# EAGLE schematic board_V2 (EAGLE 9.3.1)
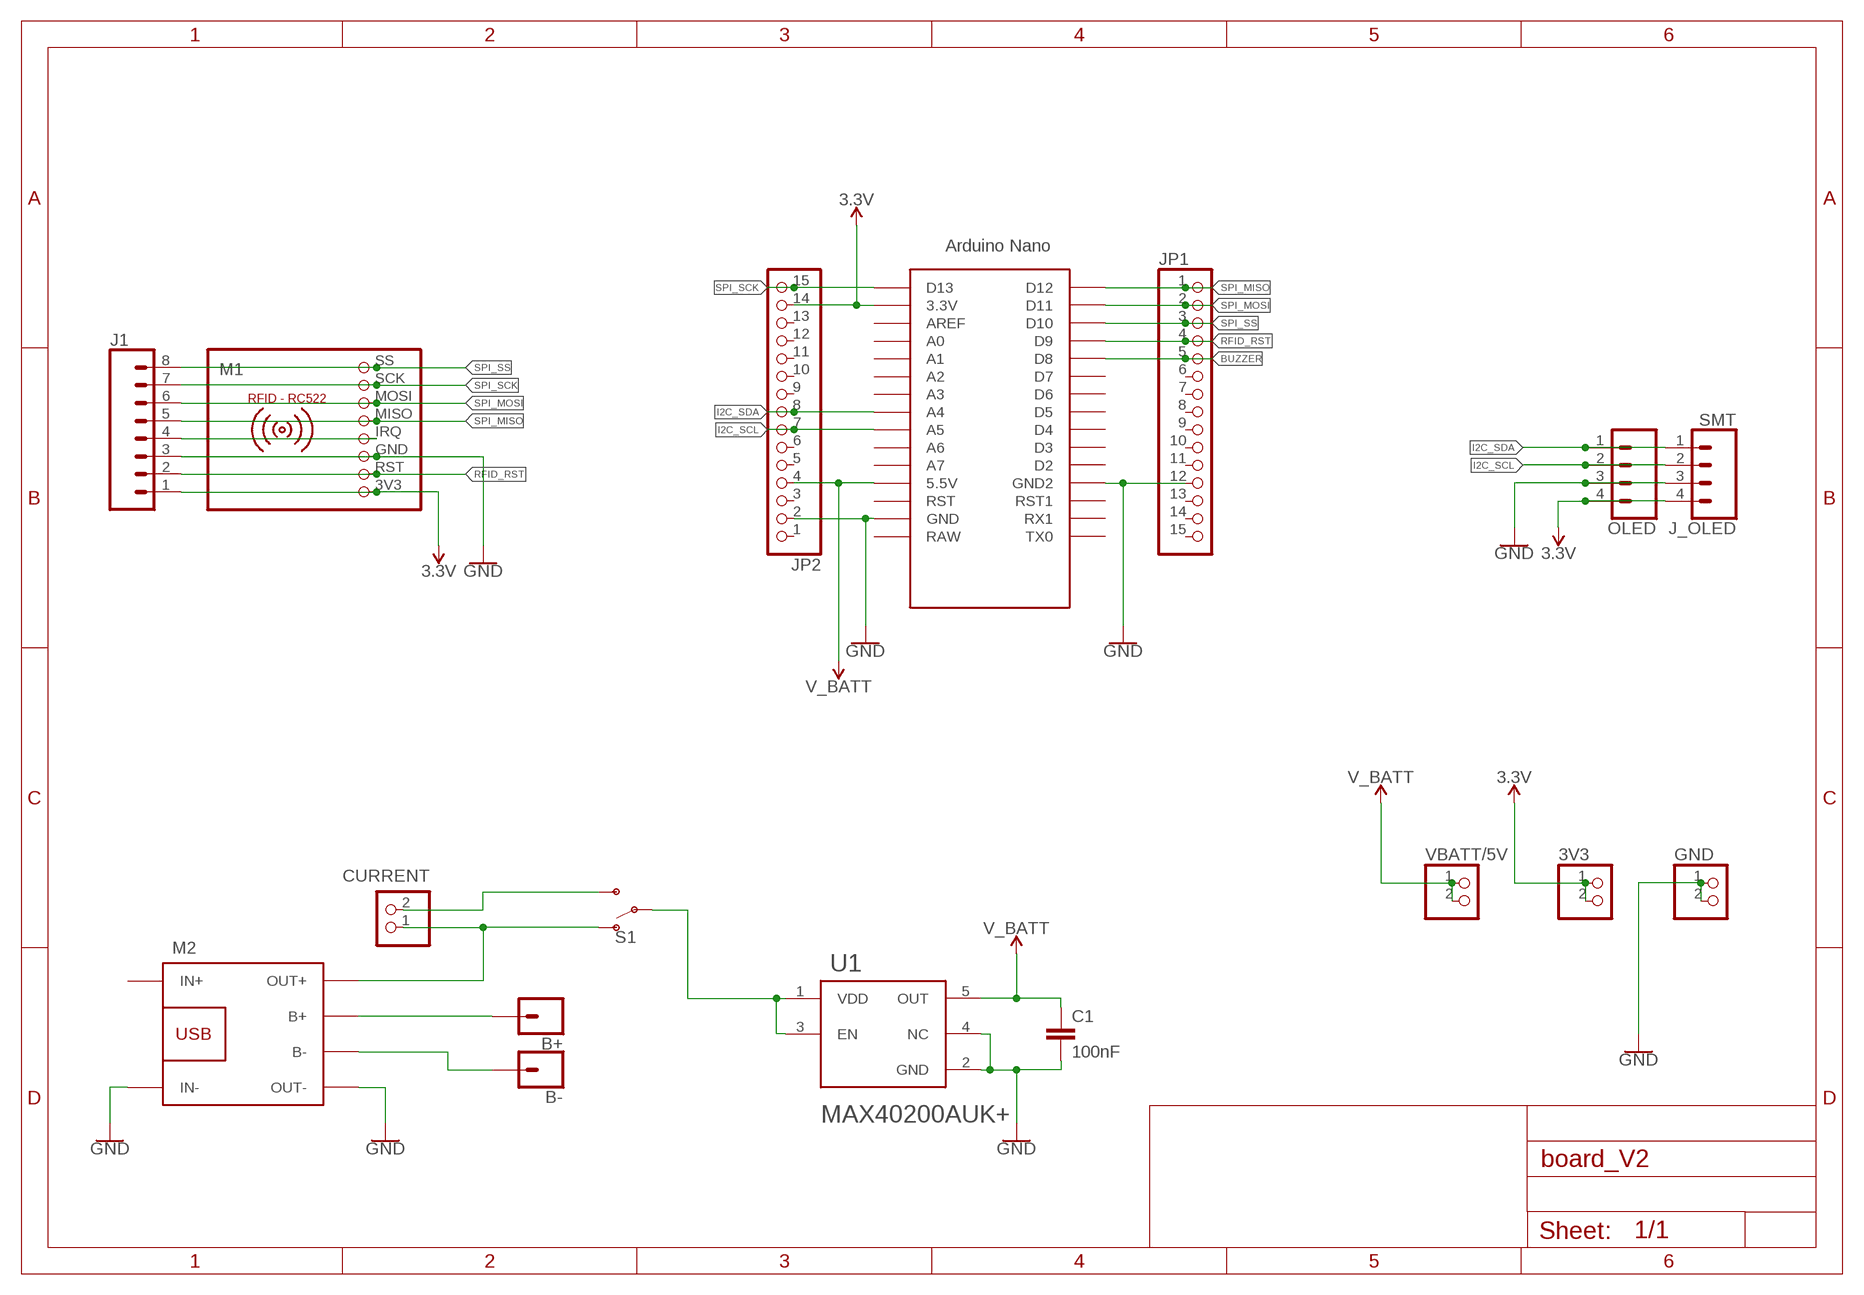
[diagram p0: schematic, sheet 1]

## Parts
3V3  PINHD-1X2  [1X02]
B+  CONN_01OFFSET  [1X01_OFFSET]
B-  CONN_01OFFSET  [1X01_OFFSET]
C1  100nF  C-EUC0805  [C0805]
CURRENT  PINHD-1X2  [1X02]
GND  PINHD-1X2  [1X02]
J1  CONN_08SMD-COMBO-FEMALE  [1X08_SMD_COMBINED]
J_OLED  SMT  CONN_04SMD_STRAIGHT_COMBO  [1X04_SMD_VERTICAL_COMBO]
JP1  PINHD-1X151X15_SMT  [1X15_SMT]
JP2  PINHD-1X151X15_SMT  [1X15_SMT]
M1  RFID-RC522  [RFID-RC522]
M2  BATTERY-CHARGER-LI-PROT  [BATTERY-CHARGER-LI-PROT]
OLED  CONN_04  [1X04]
S1  SWITCH-SPDT-PTH-11.6X4.0MM  [SWITCH_SPDT_PTH_11.6X4.0MM]
U1  MAXIM_ELECTRONICS_MAX40200AUK+MAXIM_ELECTRONICS_MAX40200AUK+_0_0  [MAXIM_ELECTRONICS_MAX40200AUK+_0]
U$1  NANO_ICSP-REMOVED  [NANO_ICSP-REMOVED]
VBATT/5V  PINHD-1X2  [1X02]

## Nets
3.3V [power]: 3V3.1 3V3.2 J1.1 J_OLED.4 JP2.14 M1.3V3 OLED.4 U$1.3.3V
BATT_VOUT [power]: S1.2(P) U1.1(VDD) U1.3(EN)
BUZZER: JP1.5 U$1.D8
GND [power]: C1.2 GND.1 GND.2 J1.3 J_OLED.3 JP1.12 JP2.2 M1.GND M2.IN- M2.OUT- OLED.3 U1.2(GND) U1.4(NC) U$1.GND U$1.GND1(GND2)
I2C_SCL: J_OLED.2 JP2.7 OLED.2 U$1.A5
I2C_SDA: J_OLED.1 JP2.8 OLED.1 U$1.A4
N$1 [power]: B+.1 M2.B+
N$2 [power]: CURRENT.1 M2.OUT+ S1.1(O)
N$3: J1.4 M1.IRQ
N$4 [power]: CURRENT.2 S1.3(S)
N$5 [power]: B-.1 M2.B-
RFID_RST: J1.2 JP1.4 M1.RST U$1.D9
SPI_MISO: J1.5 JP1.1 M1.MISO U$1.D12
SPI_MOSI: J1.6 JP1.2 M1.MOSI U$1.D11
SPI_SCK: J1.7 JP2.15 M1.SCK U$1.D13
SPI_SS: J1.8 JP1.3 M1.SS U$1.D10
V_BATT [power]: C1.1 JP2.4 U1.5(OUT) U$1.5V(5.5V) VBATT/5V.1 VBATT/5V.2
Unconnected: JP1.6 JP1.7 JP1.8 JP1.9 JP1.10 JP1.11 JP1.13 JP1.14 JP1.15 JP2.1 JP2.3 JP2.5 JP2.6 JP2.9 JP2.10 JP2.11 JP2.12 JP2.13 M2.IN+ U$1.A0 U$1.A1 U$1.A2 U$1.A3 U$1.A6 U$1.A7 U$1.AREF U$1.D2 U$1.D3 U$1.D4 U$1.D5 U$1.D6 U$1.D7 U$1.RAW U$1.RST U$1.RST1 U$1.RX1 U$1.TX0

## Library data of the parts
3V3 CURRENT GND VBATT/5V = pinhead:PINHD-1X2: PIN HEADER
B+ B- = SparkFun-Connectors:CONN_01: Single connection point. Often used as Generic Header-pin footprint for 0.1 inch spaced/style header connections On any of the 0.1 inch spaced packages, you can populate with these: Break Away Headers - Straight <https://www.sparkfun.com/products/116> (PRT-00116) Break Away Male Headers - Right Angle <https://www.sparkfun.com/products/553> (PRT-00553) Female Headers <https://www.sparkfun.com/products/115> (PRT-00115) Break Away Headers - Machine Pin <https://www.sparkfun.com/products/117> (PRT-00117) Break Away Female Headers - Swiss Machine Pin <https://www.sparkfun.com/products/743> (PRT-00743) This device is also useful as a general connection point to wire up your design to another part of your project. Our various solder wires solder well into these plated through hole pads. Hook-Up Wire - Assortment (Stranded, 22 AWG) <https://www.sparkfun.com/products/11375> (PRT-11375) Hook-Up Wire - Assortment (Solid Core, 22 AWG) <https://www.sparkfun.com/products/11367> (PRT-11367) View the entire wire category on our website here <https://www.sparkfun.com/categories/141> Special notes: SMTSO-256-ET is a "flush mount" nut for a 4-40 screw. We mostly use this on specialty testbeds; it is a nice way to connect hardware to your PCB at an adjustable hieght. Also note, the SNAP packages are for using a snappable style connector. We sell a baggie of snaps and they are also used on two LilyPad designs: Snap Assortment - 30 pack (male and female) <https://www.sparkfun.com/products/11347> (DEV-11347) LilyPad Arduino SimpleSnap <https://www.sparkfun.com/products/10941> (DEV-10941) LilyPad SimpleSnap Protoboard <https://www.sparkfun.com/products/10940> (DEV-10940)
C1 = rcl:C-EU: CAPACITOR, European symbol; SPICEPREFIX: C
J1 = SparkFun-Connectors:CONN_08: Multi connection point. Often used as Generic Header-pin footprint for 0.1 inch spaced/style header connections On any of the 0.1 inch spaced packages, you can populate with these: Break Away Headers - Straight <https://www.sparkfun.com/products/116> (PRT-00116) Break Away Male Headers - Right Angle <https://www.sparkfun.com/products/553> (PRT-00553) Female Headers <https://www.sparkfun.com/products/115> (PRT-00115) Break Away Headers - Machine Pin <https://www.sparkfun.com/products/117> (PRT-00117) Break Away Female Headers - Swiss Machine Pin <https://www.sparkfun.com/products/743> (PRT-00743) Arduino Stackable Header - 8 Pin <https://www.sparkfun.com/products/9279> (PRT-09279) For SCREWTERMINALS and SPRING TERMINALS visit here: Screw Terimnals on SparkFun.com <https://www.sparkfun.com/search/results?term=Screw+Terminals> (5mm/3.5mm/2.54mm spacing) This device is also useful as a general connection point to wire up your design to another part of your project. Our various solder wires solder well into these plated through hole pads. Hook-Up Wire - Assortment (Stranded, 22 AWG) <https://www.sparkfun.com/products/11375> (PRT-11375) Hook-Up Wire - Assortment (Solid Core, 22 AWG) <https://www.sparkfun.com/products/11367> (PRT-11367) View the entire wire category on our website here <https://www.sparkfun.com/categories/141> Special notes: Molex polarized connector foot print use with SKU : PRT-08231 with associated crimp pins and housings. 1MM SMD Version SKU: PRT-10208 NOTES ON THE VARIANTS LOCK and LOCK_LONGPADS... This footprint was designed to help hold the alignment of a through-hole component (i.e. 6-pin header) while soldering it into place. You may notice that each hole has been shifted either up or down by 0.005 of an inch from it's more standard position (which is a perfectly straight line). This slight alteration caused the pins (the squares in the middle) to touch the edges of the holes. Because they are alternating, it causes a "brace" to hold the component in place. 0.005 has proven to be the perfect amount of "off-center" position when using our standard breakaway headers. Although looks a little odd when you look at the bare footprint, once you have a header in there, the alteration is very hard to notice. Also,if you push a header all the way into place, it is covered up entirely on the bottom side.; PROD_ID: CONN-10204; SF_ID: PRT-11543
J_OLED = SparkFun-Connectors:CONN_04: Multi connection point. Often used as Generic Header-pin footprint for 0.1 inch spaced/style header connections On any of the 0.1 inch spaced packages, you can populate with these: Break Away Headers - Straight <https://www.sparkfun.com/products/116> (PRT-00116) Break Away Male Headers - Right Angle <https://www.sparkfun.com/products/553> (PRT-00553) Female Headers <https://www.sparkfun.com/products/115> (PRT-00115) Break Away Headers - Machine Pin <https://www.sparkfun.com/products/117> (PRT-00117) Break Away Female Headers - Swiss Machine Pin <https://www.sparkfun.com/products/743> (PRT-00743) For SCREWTERMINALS and SPRING TERMINALS visit here: Screw Terimnals on SparkFun.com <https://www.sparkfun.com/search/results?term=Screw+Terminals> (5mm/3.5mm/2.54mm spacing) This device is also useful as a general connection point to wire up your design to another part of your project. Our various solder wires solder well into these plated through hole pads. Hook-Up Wire - Assortment (Stranded, 22 AWG) <https://www.sparkfun.com/products/11375> (PRT-11375) Hook-Up Wire - Assortment (Solid Core, 22 AWG) <https://www.sparkfun.com/products/11367> (PRT-11367) View the entire wire category on our website here <https://www.sparkfun.com/categories/141> Special notes: Molex polarized connector foot print use with SKU : PRT-08231 with associated crimp pins and housings. 1MM SMD Version SKU: PRT-10208; PROD_ID: CONN-08511; VALUE: 1X04_SMD_STRAIGHT_COMBO
JP1 JP2 = pinhead+:PINHD-1X15: PIN HEADER
M1 = mfrc522-module:RFID-RC522: RFID-RC522 MFRC-522 based breakout board
M2 = diy-modules:BATTERY-CHARGER-LI-PROT: Lithium Battery 5V Charger with protection circuit More details available here: http://www.instructables.com/id/DIY-Lithium-ion-Battery-Charger/step4/TP4056-based-lithium-ion-battery-charger-module/ Click here to find device on ebay.com <http://www.ebay.com/sch/tp4056+charger+usb+protection>
OLED = SparkFun-Connectors:CONN_04: Multi connection point. Often used as Generic Header-pin footprint for 0.1 inch spaced/style header connections On any of the 0.1 inch spaced packages, you can populate with these: Break Away Headers - Straight <https://www.sparkfun.com/products/116> (PRT-00116) Break Away Male Headers - Right Angle <https://www.sparkfun.com/products/553> (PRT-00553) Female Headers <https://www.sparkfun.com/products/115> (PRT-00115) Break Away Headers - Machine Pin <https://www.sparkfun.com/products/117> (PRT-00117) Break Away Female Headers - Swiss Machine Pin <https://www.sparkfun.com/products/743> (PRT-00743) For SCREWTERMINALS and SPRING TERMINALS visit here: Screw Terimnals on SparkFun.com <https://www.sparkfun.com/search/results?term=Screw+Terminals> (5mm/3.5mm/2.54mm spacing) This device is also useful as a general connection point to wire up your design to another part of your project. Our various solder wires solder well into these plated through hole pads. Hook-Up Wire - Assortment (Stranded, 22 AWG) <https://www.sparkfun.com/products/11375> (PRT-11375) Hook-Up Wire - Assortment (Solid Core, 22 AWG) <https://www.sparkfun.com/products/11367> (PRT-11367) View the entire wire category on our website here <https://www.sparkfun.com/categories/141> Special notes: Molex polarized connector foot print use with SKU : PRT-08231 with associated crimp pins and housings. 1MM SMD Version SKU: PRT-10208; PROD_ID: CONN-09696
S1 = SparkFun-Switches:SWITCH-SPDT: Single Pole, Double Throw (SPDT) Switch Single-pole, double-throw (SPDT) switch. Variant Overview SMD-AYZ0202 Surface Mount DPDT Switch <https://www.sparkfun.com/products/597> (COM-00597) Used on e.g. LilyPad Arduino USB - ATmega32U4 Board <https://www.sparkfun.com/products/12049> PTH-11.6X4.0MM SPDT Mini Power Switch <https://www.sparkfun.com/products/102> (COM-00102) Used on e.g. SparkFun Simon Says - Through-Hole Soldering Kit <https://www.sparkfun.com/products/10547> (KIT-10547) PTH-11.6X4.0MM-KIT KIT version of SPDT Mini Power Switch - Simplifies soldering by removing tStop of switch pins - only one side can be soldered. PTH-11.6X4.0MM-LOCK LOCK version of SPDT Mini Power Switch - Offset pins hold switch in place for easier soldering. SMD-RIGHT-ANGLE Surface Mount Right Angle Switch <https://www.sparkfun.com/products/10860> (COM-10860) Used on e.g. SparkFun ESP8266 Thing <https://www.sparkfun.com/products/13231>; PROD_ID: SWCH-08261; SF_SKU: COM-00102
U1 = Maxim Electronics - MAX40200AUK+:MAXIM_ELECTRONICS_MAX40200AUK+: IDEAL DIODE CURRENT SW, 5.5V, SOT23-5; CENTROID_NOT_SPECIFIED: No; DATASHEET: https://datasheets.maximintegrated.com/en/ds/MAX40200.pdf; DEVICE_CLASS_L1: Integrated Circuits (ICs); DEVICE_CLASS_L2: Power Management ICs; DEVICE_CLASS_L3: unset; DIGIKEY_DESCRIPTION: IC DIODE CURRENT SWITCH SOT23-5; DIGIKEY_PART_NUMBER: MAX40200AUK+-ND; FOOTPRINT_URL: https://pdfserv.maximintegrated.com/land_patterns/90-0174.PDF; HEIGHT: 1.45mm; LEAD_FREE: yes; MAX_JUNCTION_TEMP: +150°C; MAX_POWER_DISSIPATION: 312.6mW; MAX_SUPPLY_VOLTAGE: 5.5V; MF: Maxim Electronics; MFG_PACKAGE_IDENT: U5-1; MFG_PACKAGE_IDENT_DATE: 0; MFG_PACKAGE_IDENT_REV: J; MIN_SUPPLY_VOLTAGE: 1.5V; MOUSER_PART_NUMBER: 700-MAX40200AUK+; MPN: MAX40200AUK+; NOMINAL_SUPPLY_CURRENT: 7uA; NUMBER_OF_OUTPUTS: 1; OUTPUT_CURRENT: 1A; PACKAGE: SOT23-5; PREFIX: U; ROHS: yes; STANDOFF_HEIGHT: 0mm; TEMPERATURE_RANGE_HIGH: +125°C; TEMPERATURE_RANGE_LOW: -40°C; VERIFICATION_VERSION: 0.0.0.1
U$1 = Arduino-clone:NANO_ICSP-REMOVED

## Module BUZZER
Ports: 

### Library data of the parts

## Net classes
1 power: width 0.914 mm, clearance 0.254 mm